# Altium schematic sheet LIS3DH.SchDoc
size A3; SheetNumber: 5; SheetTotal: 5
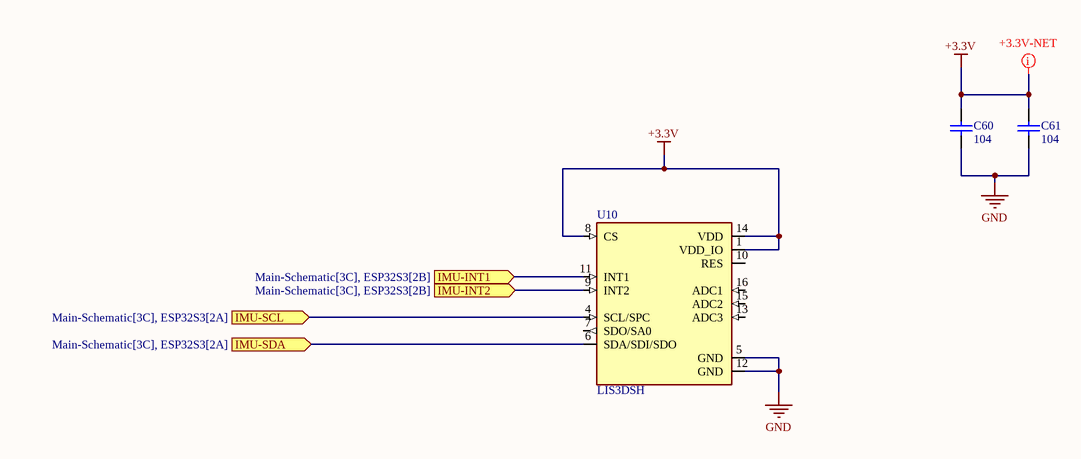
[diagram p0: LIS3DH.SchDoc]

## Parts
C60  104  [CAP_0603]
C61  104  [CAP_0603]
U10  LIS3DSH  [LGA16R50P5X3_300X300X100N]

## Ports
IMU-INT1 (in, see Main-Schematic[3C], ESP32S3[2B]), IMU-INT2 (in, see Main-Schematic[3C], ESP32S3[2B]), IMU-SCL (in, see Main-Schematic[3C], ESP32S3[2A]), IMU-SDA (in, see Main-Schematic[3C], ESP32S3[2A])

## Nets
+3.3V: C60.2 C61.2 U10.1(VDD_IO) U10.8(CS) U10.14(VDD)
GND: C60.1 C61.1 U10.5(GND) U10.12(GND)
IMU-INT1: U10.11(INT1) ; port IMU-INT1
IMU-INT2: U10.9(INT2) ; port IMU-INT2
IMU-SCL: U10.4(SCL/SPC) ; port IMU-SCL
IMU-SDA: U10.6(SDA/SDI/SDO) ; port IMU-SDA

Not connected (* = marked no-connect by the designer): U10 7(SDO/SA0) 10(RES) 13(ADC3) 15(ADC2) 16(ADC1)

## Layout directives
net class POWER: +3.3V

## Library data of the parts
C60 C61 = Cap_NP: Non-polarized capacitor
U10 = LIS3DSH: Accelerometer X, Y, Z Axis Â±2g, 4g, 6g, 8g, 16g 1.56Hz ~ 800Hz 16-LGA _3x3_; MF: STMicroelectronics; Availability: Unavailable; Value: *; Package: LGA-16 STMicroelectronics; Price: None; SnapEDA_Link: https://www.snapeda.com/parts/LIS3DSH/STMicroelectronics/view-part/422648/?ref=snap; MP: LIS3DSH